# Altium schematic sheet Top.SchDoc
size A4
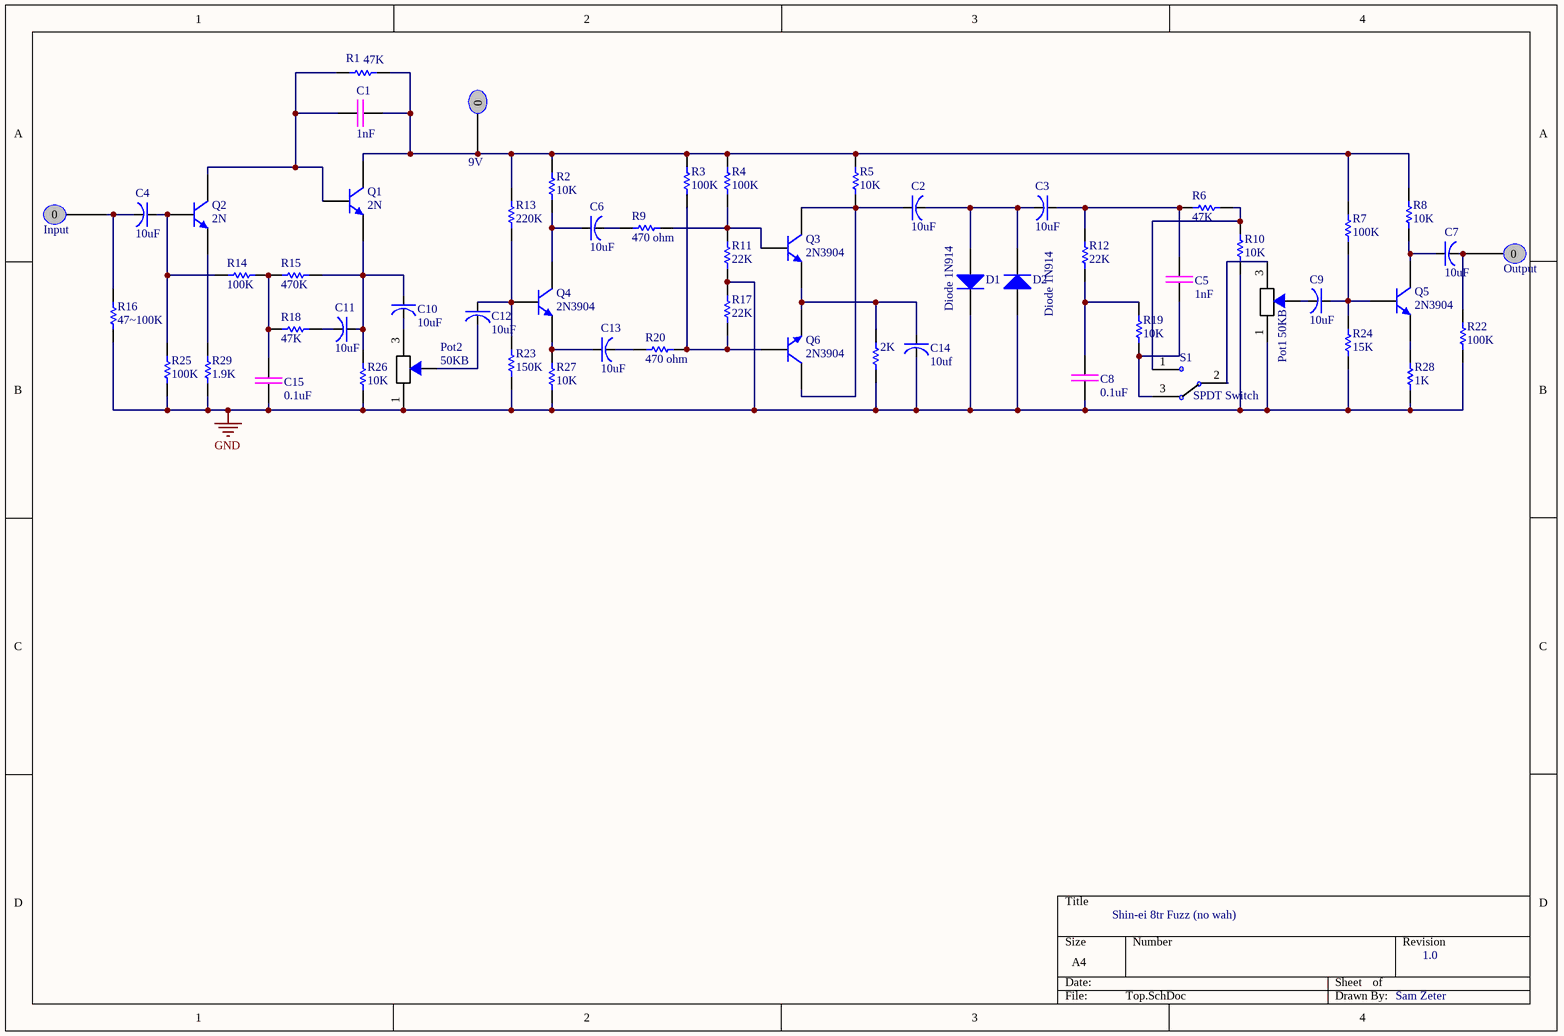
[diagram p0: Top.SchDoc]

## Parts
2K  (no value)  [RES Axial 0.5 Tayda]
9V  General purpose pad  [Pin]  (value not drawn)
C1  1nF  [Cap Green 3.5mm]
C2  10uF  [Capacitor Electrolytic 2mm]
C3  10uF  [Capacitor Electrolytic 2mm]
C4  10uF  [Capacitor Electrolytic 2mm]
C5  1nF  [Cap Green 3.5mm]
C6  10uF  [Capacitor Electrolytic 2mm]
C7  10uF  [Capacitor Electrolytic 2mm]
C8  0.1uF  [Cap Green 5.4mm]
C9  10uF  [Capacitor Electrolytic 2mm]
C10  10uF  [Capacitor Electrolytic 2mm]
C11  10uF  [Capacitor Electrolytic 2mm]
C12  10uF  [Capacitor Electrolytic 2mm]
C13  10uF  [Capacitor Electrolytic 2mm]
C14  10uf  [Capacitor Electrolytic 2mm]
C15  0.1uF  [Cap Green 5.4mm]
D1  Diode 1N914  [DO-35]
D2  Diode 1N914  [DO-35]
Input  General purpose pad  [Pin]  (value not drawn)
Output  General purpose pad  [Pin]  (value not drawn)
Pot1  50KB  [Potentiometer]
Pot2  50KB  [Potentiometer]
Q1  2N  [NPN Transistor Wide]
Q2  2N  [NPN Transistor Wide]
Q3  2N3904  [NPN Transistor Wide]
Q4  2N3904  [NPN Transistor Wide]
Q5  2N3904  [NPN Transistor Wide]
Q6  2N3904  [NPN Transistor Wide]
R1  47K  [RES Axial 0.5 Tayda]
R2  10K  [RES Axial 0.5 Tayda]
R3  100K  [RES Axial 0.5 Tayda]
R4  100K  [RES Axial 0.5 Tayda]
R5  10K  [RES Axial 0.5 Tayda]
R6  47K  [RES Axial 0.5 Tayda]
R7  100K  [RES Axial 0.5 Tayda]
R8  10K  [RES Axial 0.5 Tayda]
R9  470 ohm  [RES Axial 0.5 Tayda]
R10  10K  [RES Axial 0.5 Tayda]
R11  22K  [RES Axial 0.5 Tayda]
R12  22K  [RES Axial 0.5 Tayda]
R13  220K  [RES Axial 0.5 Tayda]
R14  100K  [RES Axial 0.5 Tayda]
R15  470K  [RES Axial 0.5 Tayda]
R16  47~100K  [RES Axial 0.5 Tayda]
R17  22K  [RES Axial 0.5 Tayda]
R18  47K  [RES Axial 0.5 Tayda]
R19  10K  [RES Axial 0.5 Tayda]
R20  470 ohm  [RES Axial 0.5 Tayda]
R22  100K  [RES Axial 0.5 Tayda]
R23  150K  [RES Axial 0.5 Tayda]
R24  15K  [RES Axial 0.5 Tayda]
R25  100K  [RES Axial 0.5 Tayda]
R26  10K  [RES Axial 0.5 Tayda]
R27  10K  [RES Axial 0.5 Tayda]
R28  1K  [RES Axial 0.5 Tayda]
R29  1.9K  [RES Axial 0.5 Tayda]
S1  SPDT Switch  [SPDT Switch]

## Nets
GND: 2K.1 C8.1 C14.2 C15.1 D1.2(K) D2.1(A) Pot1.1 Pot2.1 R10.1 R11.1 R16.1 R17.2 R22.1 R23.1 R24.1 R25.1 R26.1 R27.1 R28.1 R29.1
Net2K_2: 2K.2 C14.1 Q3.3(E) Q6.3(E)
Net9V_0: 9V.0 C1.2 Q1.1(C) R1.2 R2.2 R3.2 R4.2 R5.2 R7.2 R8.2 R13.2
NetC1_1: C1.1 Q1.2(B) Q2.1(C) R1.1
NetC2_1: C2.1 Q3.1(C) Q6.1(C) R5.1
NetC2_2: C2.2 C3.2 D1.1(A) D2.2(K)
NetC3_1: C3.1 C5.2 R6.2 R12.2
NetC4_1: C4.1 Q2.2(B) R14.1 R25.2
NetC4_2: C4.2 Input.0 R16.2
NetC5_1: C5.1 R19.1 S1.3
NetC6_1: C6.1 Q4.1(C) R2.1
NetC6_2: C6.2 R9.1
NetC7_1: C7.1 Q5.1(C) R8.1
NetC7_2: C7.2 Output.0 R22.2
NetC8_2: C8.2 R12.1 R19.2
NetC9_1: C9.1 Q5.2(B) R7.1 R24.2
NetC9_2: C9.2 Pot1.2
NetC10_1: C10.1 C11.1 Q1.3(E) R15.2 R26.2
NetC10_2: C10.2 Pot2.3
NetC11_2: C11.2 R18.2
NetC12_1: C12.1 Q4.2(B) R13.1 R23.2
NetC12_2: C12.2 Pot2.2
NetC13_1: C13.1 Q4.3(E) R27.2
NetC13_2: C13.2 R20.1
NetC15_2: C15.2 R14.2 R15.1 R18.1
NetPot1_3: Pot1.3 S1.2
NetQ2_3: Q2.3(E) R29.2
NetQ3_2: Q3.2(B) R4.1 R9.2 R11.2
NetQ5_3: Q5.3(E) R28.2
NetQ6_2: Q6.2(B) R3.1 R17.1 R20.2
NetR6_1: R6.1 R10.2 S1.1

## Notes on the sheet
- Shin-ei 8tr Fuzz (no wah)
- 1.0
- Sam Zeter

## Library data of the parts
2K R1-R20 R22-R27 R29 = Res 0.5: Radial 1/4 Watt Tayda; Value: 1K; Published: 8-Jun-2000; LatestRevisionDate: 17-Jul-2002; LatestRevisionNote: Re-released for DXP Platform.; PackageReference: AXIAL-0.3; Publisher: Altium Limited; PackageDescription: Axial Device, Thru-Hole; 2 Leads; 0.3 in Pin Spacing
9V Input Output = Pad
C1 C5 = Cap Green 3.5mm: 3.5mm spaced leads for green caps
C2-C4 C6 C7 C9-C14 = Cap Elec 2mm: 2mm Lead Spaced Electro Cap
C8 C15 = Cap Green 5.4mm spaced Tayda green caps: 5.4mm spaced Tayda green caps
D1 D2 = Diode 1N914: High Conductance Fast Diode; Published: 8-Jun-2000; LatestRevisionDate: 17-Jul-2002; LatestRevisionNote: Re-released for DXP Platform.; DatasheetVersion: 1997; PackageReference: DO-35; Publisher: Altium Limited; PackageDescription: Diode, Axial; Body 3.8 x 1.9 mm (LxDia. max), Lead Dia. 0.53 mm (max); Code_JEDEC: DO-204-AH; ComponentLink1Description: Manufacturer Link; ComponentLink1URL: http://www.fairchildsemi.com/; ComponentLink2Description: Datasheet; ComponentLink2URL: http://www.fairchildsemi.com/ds/1N%2F1N4448.pdf
Pot1 Pot2 = Potentiometer: My Own
Q1-Q6 = NPN Transistor: NPN  Larger Leg Spacing
R28 = Res 0.5: Radial 1/4 Watt Tayda; Published: 8-Jun-2000; LatestRevisionDate: 17-Jul-2002; LatestRevisionNote: Re-released for DXP Platform.; PackageReference: AXIAL-0.3; Publisher: Altium Limited; PackageDescription: Axial Device, Thru-Hole; 2 Leads; 0.3 in Pin Spacing; Value: 1K